# EAGLE design led (EAGLE 7.6.0)
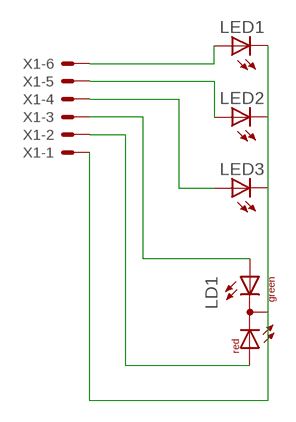
[diagram p0: schematic, sheet 1]

## Parts
LD1  DUOLED-RG-C  [DUOLED-C-5MM]
LED1  LED5MM  [LED5MM]
LED2  LED5MM  [LED5MM]
LED3  LED5MM  [LED5MM]
X1  22-23-2061  [22-23-2061]

## Nets
GND: LD1.C LED1.K(C) LED2.K(C) LED3.K(C) X1.1
N$1: LED1.A X1.6
N$2: LED2.A X1.5
N$3: LED3.A X1.4
N$4: LD1.AX(AG) X1.3
N$5: LD1.AR X1.2

## Library data of the parts
LD1 = led:DUOLED-RG-C: DUO LED 2 colors (red/green), 5 mm, round, common Cathode www.ligitek.com or other producers.
LED1-LED3 = led:LED: LED OSRAM: - CHIPLED LG R971, LG N971, LY N971, LG Q971, LY Q971, LO R971, LY R971 LH N974, LH R974 LS Q976, LO Q976, LY Q976 LO Q996 - Hyper CHIPLED LW Q18S LB Q993, LB Q99A, LB R99A - SideLED LS A670, LO A670, LY A670, LG A670, LP A670 LB A673, LV A673, LT A673, LW A673 LH A674 LY A675 LS A676, LA A676, LO A676, LY A676, LW A676 LS A679, LY A679, LG A679 - Hyper Micro SIDELED® LS Y876, LA Y876, LO Y876, LY Y876 LT Y87S - SmartLED LW L88C, LW L88S LB L89C, LB L89S, LG L890 LS L89K, LO L89K, LY L89K LS L896, LA L896, LO L896, LY L896 - TOPLED LS T670, LO T670, LY T670, LG T670, LP T670 LSG T670, LSP T670, LSY T670, LOP T670, LYG T670 LG T671, LOG T671, LSG T671 LB T673, LV T673, LT T673, LW T673 LH T674 LS T676, LA T676, LO T676, LY T676, LB T676, LH T676, LSB T676, LW T676 LB T67C, LV T67C, LT T67C, LS T67K, LO T67K, LY T67K, LW E67C LS E67B, LA E67B, LO E67B, LY E67B, LB E67C, LV E67C, LT E67C LW T67C LS T679, LY T679, LG T679 LS T770, LO T770, LY T770, LG T770, LP T770 LB T773, LV T773, LT T773, LW T773 LH T774 LS E675, LA E675, LY E675, LS T675 LS T776, LA T776, LO T776, LY T776, LB T776 LHGB T686 LT T68C, LB T68C - Hyper Mini TOPLED® LB M676 - Mini TOPLED Santana® LG M470 LS M47K, LO M47K, LY M47K Source: http://www.osram.convergy.de LUXEON: - LUMILED® LXK2-PW12-R00, LXK2-PW12-S00, LXK2-PW14-U00, LXK2-PW14-V00 LXK2-PM12-R00, LXK2-PM12-S00, LXK2-PM14-U00 LXK2-PE12-Q00, LXK2-PE12-R00, LXK2-PE12-S00, LXK2-PE14-T00, LXK2-PE14-U00 LXK2-PB12-K00, LXK2-PB12-L00, LXK2-PB12-M00, LXK2-PB14-N00, LXK2-PB14-P00, LXK2-PB14-Q00 LXK2-PR12-L00, LXK2-PR12-M00, LXK2-PR14-Q00, LXK2-PR14-R00 LXK2-PD12-Q00, LXK2-PD12-R00, LXK2-PD12-S00 LXK2-PH12-R00, LXK2-PH12-S00 LXK2-PL12-P00, LXK2-PL12-Q00, LXK2-PL12-R00 Source: www.luxeon.com KINGBRIGHT: KA-3528ASYC Source: www.kingbright.com
X1 = con-molex:22-23-2061: .100" (2.54mm) Center Header - 6 Pin; MF: MOLEX; MPN: 22-23-2061; OC_FARNELL: 1462922; OC_NEWARK: 27C1933

## Net classes
0 default: width 1.016 mm, drill 1.016 mm, clearance 1.016 mm

## Board
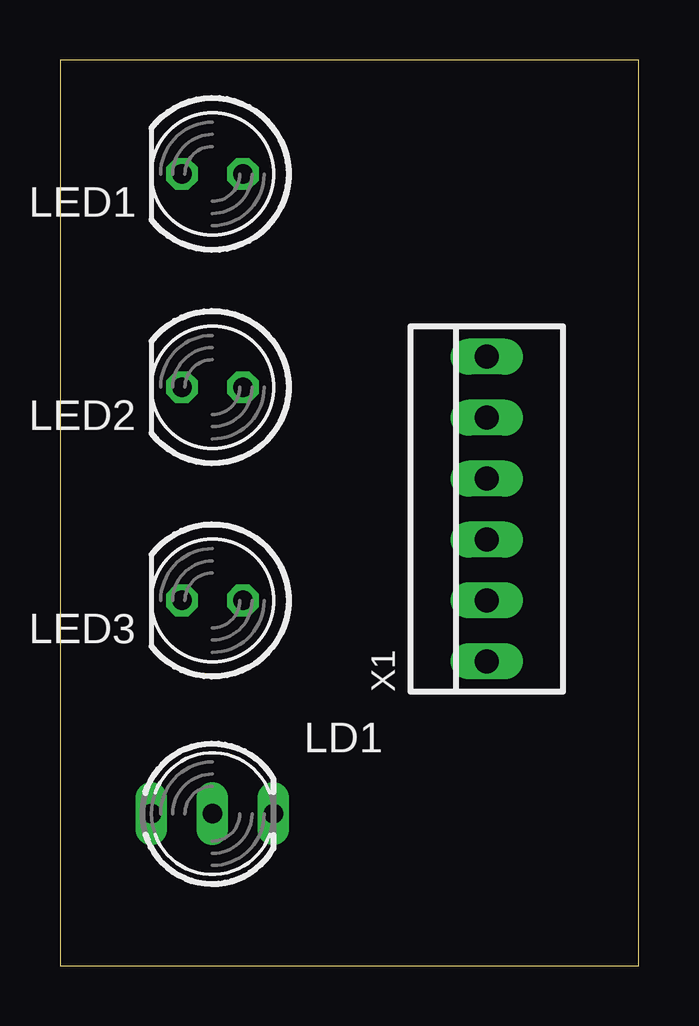
[diagram p1: board, top side]
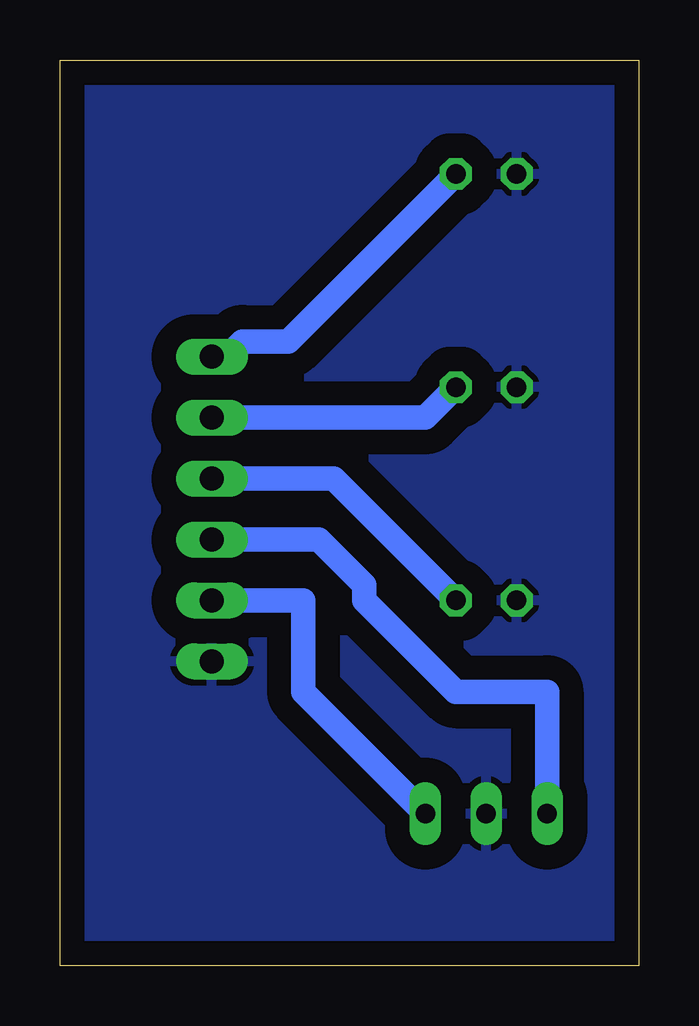
[diagram p2: board, bottom side, seen from below]

Size 24.11 x 37.77 mm. Coordinates in mm from the lower left corner, seen from the top.
Outline: 0,0 24.11,0 24.11,37.77 0,37.77 0,0
Copper layers (1*16): Top 0.035mm / dielectric 1.5mm / Bottom 0.035mm
Design rules "default": minimum track width 10mil, minimum drill 24mil, track to track 8mil, track to pad 8mil, pad to pad 8mil, via to via 8mil, smd to smd 8mil, copper to edge 40mil, drill to drill 8mil, minimum pad ring 10mil, minimum via ring 8mil, stop-mask expansion 4mil, vias tented up to drill 0mil, thermal gap 10mil

### Footprints (pad centres in the part's own frame; a part is rotated, then mirrored left to right if it is on the bottom)
DUOLED-C-5MM = drill 0.813 long: AR 2.54,0; AX -2.54,0; C 0,0
LED5MM = drill 0.813 octagon: A -1.27,0; K 1.27,0
22-23-2061 = drill 1 long: 1 -6.35,0; 2 -3.81,0; 3 -1.27,0; 4 1.27,0; 5 3.81,0; 6 6.35,0

### Placement (x,y rotation side)
LD1  6.35,6.35 0 top
LED1  6.35,33.02 180 top
LED2  6.35,24.13 180 top
LED3  6.35,15.24 180 top
X1  17.78,19.05 90 top

### Tracks (layer width: path | path; a pad name or v marks a point on that pad's centre or on a via)
GND
  pour Bottom: 0,38.1 24.13,38.1 24.13,0 0,0
N$1
  Bottom 1.016: LED1.A 14.61,26.04 16.51,26.04 17.14,25.4 X1.6
N$2
  Bottom 1.016: LED2.A 8.89,22.86 X1.5
N$3
  Bottom 1.016: LED3.A 12.7,20.32 X1.4
N$4
  Bottom 1.016: LD1.AX 3.81,11.43 7.62,11.43 11.43,15.24 11.43,15.88 13.34,17.78 X1.3
N$5
  Bottom 1.016: LD1.AR 13.97,11.43 13.97,15.24 X1.2